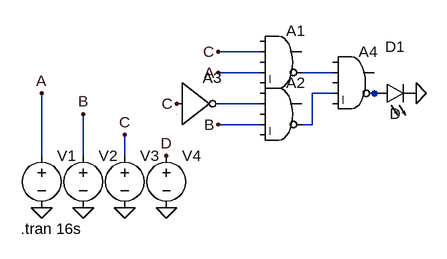
[diagram p0: schematic Draft4.asc]
Draft4.asc, the LTspice schematic file:
Version 4
SHEET 1 880 680
WIRE 96 -64 32 -64
WIRE 96 -32 32 -32
WIRE 208 -32 160 -32
WIRE 208 0 176 0
WIRE 288 0 272 0
WIRE 96 16 32 16
WIRE 96 48 32 48
WIRE 176 48 176 0
WIRE 176 48 160 48
WIRE -240 96 -240 0
WIRE -176 96 -176 32
WIRE -112 96 -112 64
FLAG -240 176 0
FLAG -176 176 0
FLAG -112 176 0
FLAG -48 176 0
FLAG -240 0 A
FLAG -176 32 B
FLAG -112 64 C
FLAG -48 96 D
FLAG 32 -64 C
FLAG -32 16 C
FLAG 32 48 B
FLAG 32 -32 A
FLAG 336 0 0
SYMBOL voltage -240 80 R0
WINDOW 3 24 96 Invisible 2
WINDOW 123 0 0 Left 0
WINDOW 39 0 0 Left 0
SYMATTR Value PULSE(1V 0V 0s 1ns 1ns 1s 2s)
SYMATTR InstName V1
SYMBOL voltage -176 80 R0
WINDOW 3 24 96 Invisible 2
WINDOW 123 0 0 Left 0
WINDOW 39 0 0 Left 0
SYMATTR Value PULSE(1V 0V 0s 1ns 1ns 2s 4s)
SYMATTR InstName V2
SYMBOL voltage -112 80 R0
WINDOW 3 24 96 Invisible 2
WINDOW 123 0 0 Left 0
WINDOW 39 0 0 Left 0
SYMATTR Value PULSE(1V 0V 0s 1ns 1ns 4s 8s)
SYMATTR InstName V3
SYMBOL voltage -48 80 R0
WINDOW 3 24 96 Invisible 2
WINDOW 123 0 0 Left 0
WINDOW 39 0 0 Left 0
SYMATTR Value PULSE(1V 0V 0s 1ns 1ns 8s 16s)
SYMATTR InstName V4
SYMBOL Digital\\and 128 -112 R0
SYMATTR InstName A1
SYMBOL Digital\\and 128 -32 R0
SYMATTR InstName A2
SYMBOL Digital\\inv -32 -48 R0
SYMATTR InstName A3
SYMBOL Digital\\and 240 -80 R0
SYMATTR InstName A4
SYMBOL LED 272 16 R270
WINDOW 0 72 32 VTop 2
WINDOW 3 0 32 VBottom 2
SYMATTR InstName D1
TEXT -272 208 Left 2 !.tran 16s

The netlist it stands for:
* Draft4.asc
V1 A 0 PULSE(1V 0V 0s 1ns 1ns 1s 2s)
V2 B 0 PULSE(1V 0V 0s 1ns 1ns 2s 4s)
V3 C 0 PULSE(1V 0V 0s 1ns 1ns 4s 8s)
V4 D 0 PULSE(1V 0V 0s 1ns 1ns 8s 16s)
A1 0 C 0 A 0 N001 0 0 AND
A2 0 N004 0 B 0 N002 0 0 AND
A3 C 0 0 0 0 N004 0 0 BUF
A4 0 N001 0 N002 0 N003 0 0 AND
D1 N003 0 D
.model D D
.lib standard.dio
.tran 16s
.backanno
.end